# Altium project Racer.PrjPcb
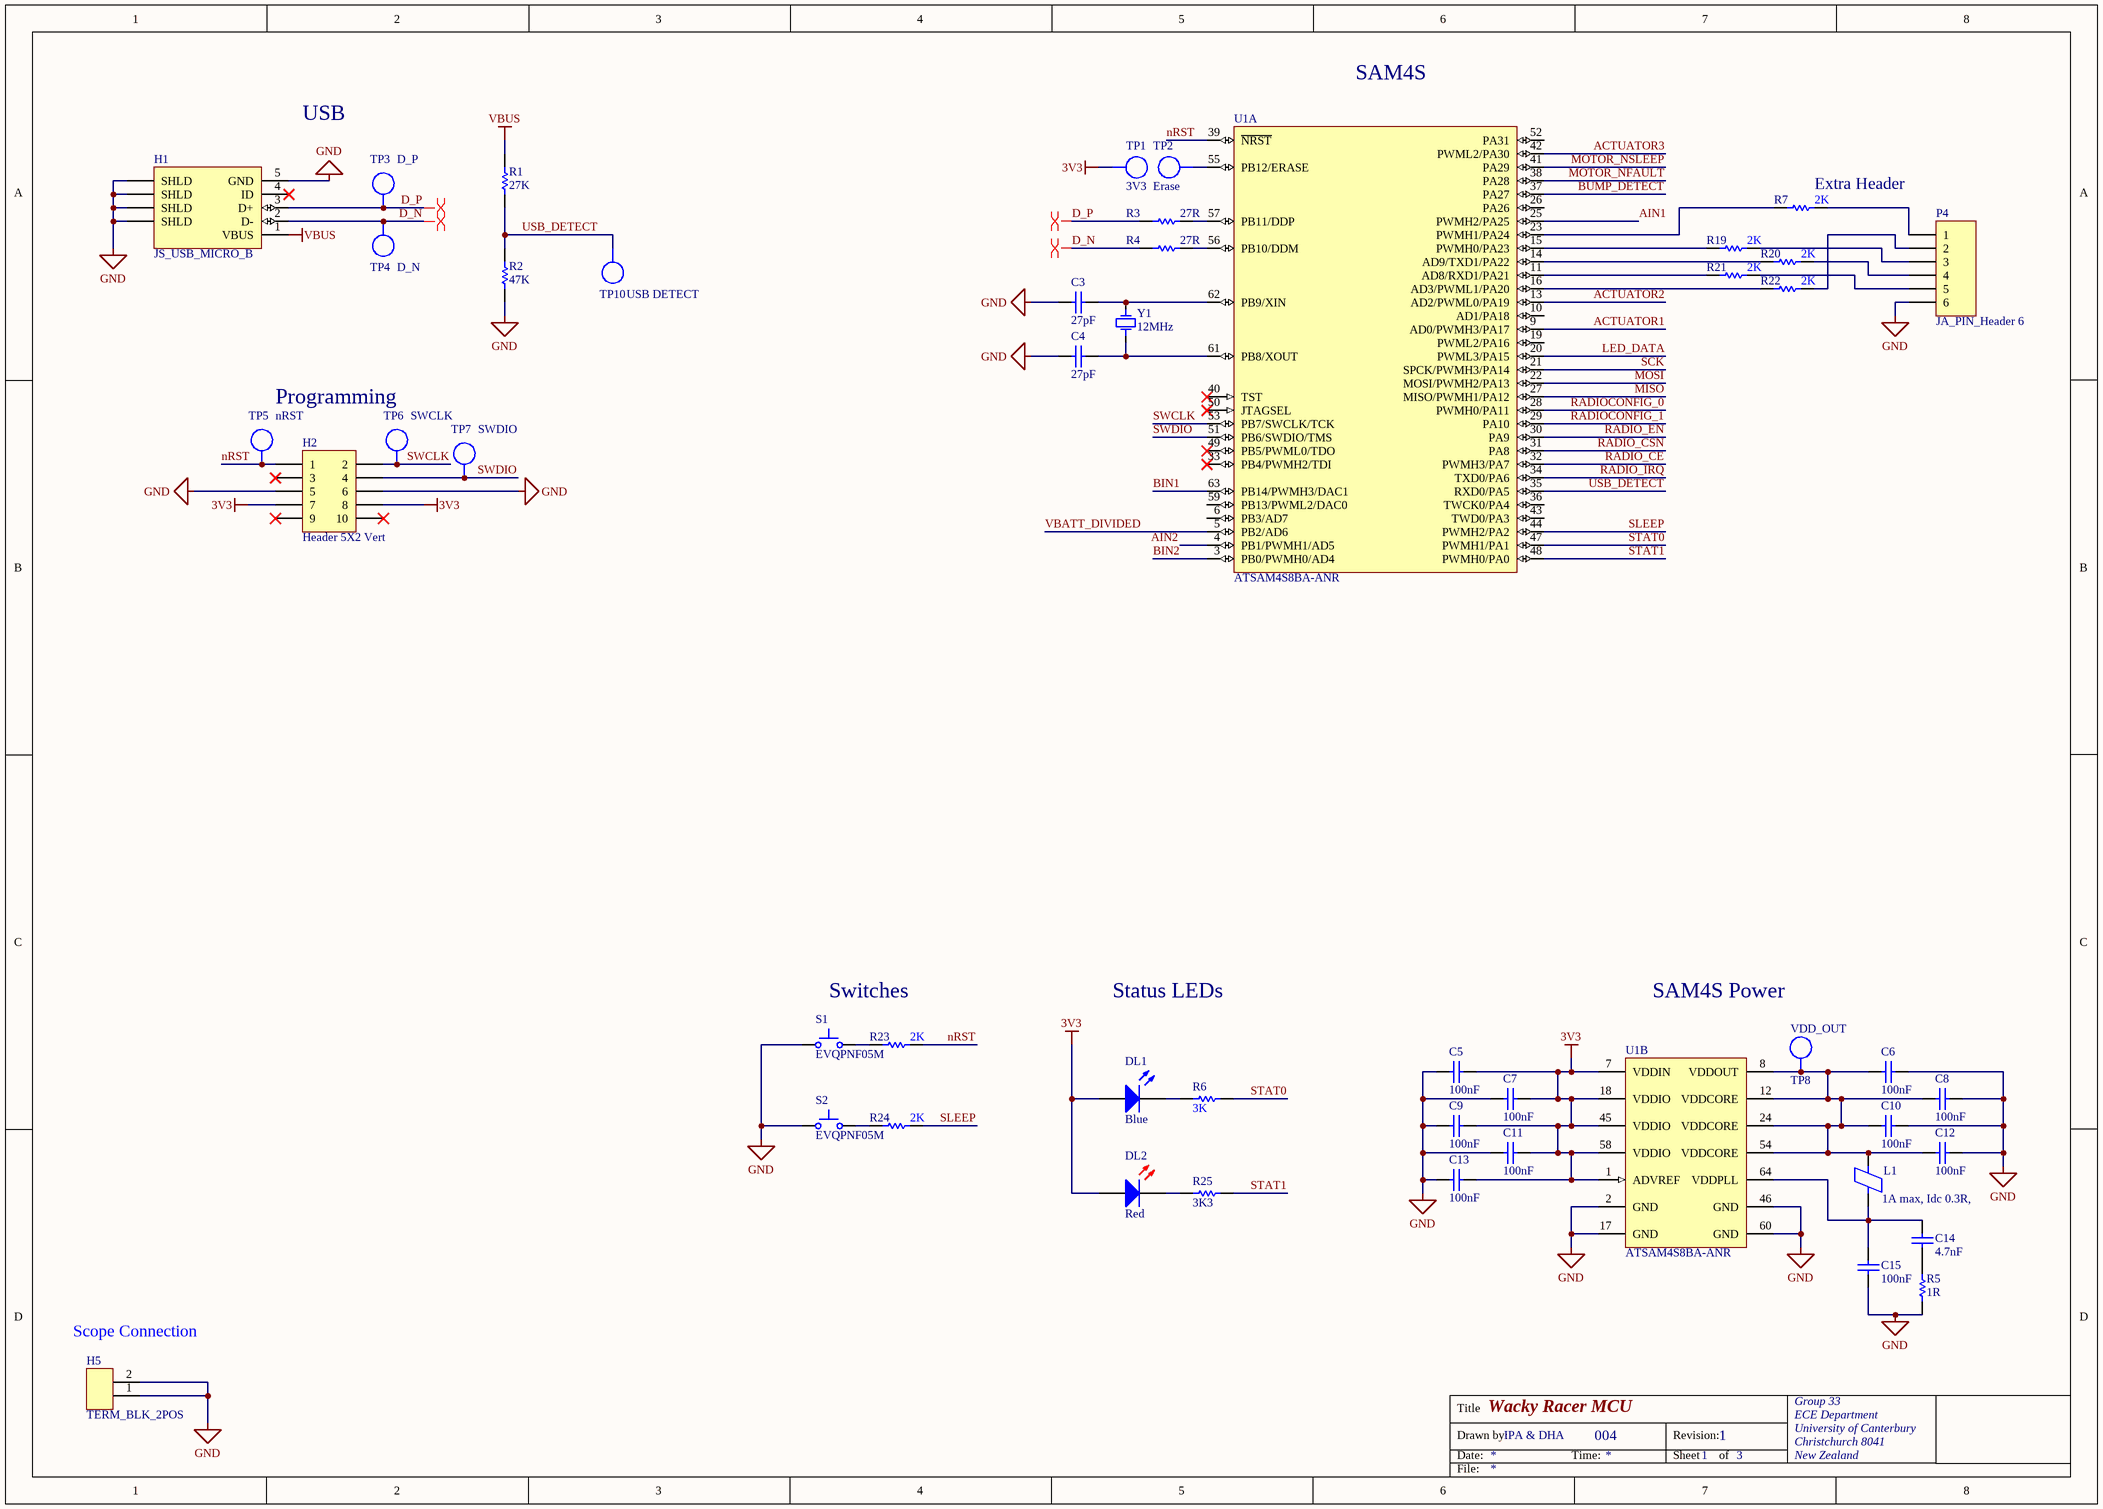
[diagram p0: MCU.SchDoc]
3 sheets, 133 parts. Net scope: global (net labels, ports and power ports of the same name join across sheets).
Board file: Car_PCB.PcbDoc
Sheets:
  MCU.SchDoc
  Peripherals.SchDoc
  Power_Supply.SchDoc

## Sheet MCU.SchDoc: Wacky Racer MCU
size A3; Author: IPA & DHA; DrawnBy: IPA & DHA; Organization: Group 33; Address1: ECE Department; Address2: University of Canterbury; Address3: Christchurch 8041; Address4: New Zealand; DocumentNumber: 004; Revision: 1; SheetNumber: 1; SheetTotal: 3; ImagePath: \\maxwell\elecapp\AltiumDesigner\Templates\uc-logo.png

### Parts
C3  27pF  [CAPC1608L]
C4  27pF  [CAPC1608L]
C5  100nF  [CAPC1608L]
C6  100nF  [CAPC1608L]
C7  100nF  [CAPC1608L]
C8  100nF  [CAPC1608L]
C9  100nF  [CAPC1608L]
C10  100nF  [CAPC1608L]
C11  100nF  [CAPC1608L]
C12  100nF  [CAPC1608L]
C13  100nF  [CAPC1608L]
C14  4.7nF  [CAPC1608L]
C15  100nF  [CAPC1608L]
DL1  Blue  [WL-SMCW0603]
DL2  Red  [WL-SMCW0603]
H1  JS_USB_MICRO_B  [FCI_USB_10118194-0001LF]
H2  Header 5X2 Vert  [IDC2.54-V10D]
H5  TERM_BLK_2POS  [TERM_BLK_2POS]
L1  1A max, Idc 0.3R,  [INDC3216L]
P4  JA_PIN_Header 6  [HDR1X6]
R1  27K  [RESC1608L]
R2  47K  [RESC1608N]
R3  27R  [RESC1608L]
R4  27R  [RESC1608L]
R5  1R  [RESC3216L]
R6  3K  [RESC1608L]
R7  2K  [RESC1608L]
R19  2K  [RESC1608L]
R20  2K  [RESC1608L]
R21  2K  [RESC1608L]
R22  2K  [RESC1608L]
R23  2K  [RESC1608L]
R24  2K  [RESC1608L]
R25  3K3  [RESC1608L]
S1  EVQPNF05M  [EVQPNF05M]
S2  EVQPNF05M  [EVQPNF05M]
TP1  3V3  [TP_1206]  (no BOM)
TP2  Erase  [TP_1206]  (no BOM)
TP3  D_P  [TP_1206]  (no BOM)
TP4  D_N  [TP_1206]  (no BOM)
TP5  nRST  [TP_1206]  (no BOM)
TP6  SWCLK  [TP_1206]  (no BOM)
TP7  SWDIO  [TP_1206]  (no BOM)
TP8  VDD_OUT  [TP_1206]  (no BOM)
TP10  USB DETECT  [TP_1206]  (no BOM)
U1  ATSAM4S8BA-ANR  [LQFP64_L]  (parts A,B of 2)
Y1  12MHz  [6.0X3.5-4]

### Nets
3V3: C5.2 C7.2 C9.2 C11.2 C13.2 DL1.2(A) DL2.2(A) H2.7 H2.8 TP1.1 U1.1(ADVREF) U1.7(VDDIN) U1.18(VDDIO) U1.45(VDDIO) U1.58(VDDIO)
GND: C3.1 C4.1 C5.1 C6.2 C7.1 C8.2 C9.1 C10.2 C11.1 C12.2 C13.1 C15.1 H1.5(GND) H1.6(SHLD) H2.5 H2.6 H5.1 H5.2 P4.6 R2.1 R5.1 S1.1 S2.1 U1.2(GND) U1.17(GND) U1.46(GND) U1.60(GND)
VBUS: H1.1(VBUS) R1.2
ACTUATOR1: U1.9(AD0/PWMH3/PA17)
ACTUATOR2: U1.13(AD2/PWML0/PA19)
ACTUATOR3: U1.42(PWML2/PA30)
AIN1: U1.25(PWMH2/PA25)
AIN2: U1.4(PB1/PWMH1/AD5)
BIN1: U1.63(PB14/PWMH3/DAC1)
BIN2: U1.3(PB0/PWMH0/AD4)
BUMP_DETECT: U1.37(PA27)
D_N: H1.2(D-) R4.1 TP4.1
D_P: H1.3(D+) R3.1 TP3.1
LED_DATA: U1.20(PWML3/PA15)
MISO: U1.27(MISO/PWMH1/PA12)
MOSI: U1.22(MOSI/PWMH2/PA13)
MOTOR_NFAULT: U1.38(PA28)
MOTOR_NSLEEP: U1.41(PA29)
nRST: H2.1 R23.2 TP5.1 U1.39(~{NRST})
RADIO_CE: U1.32(PWMH3/PA7)
RADIO_CSN: U1.31(PA8)
RADIO_EN: U1.30(PA9)
RADIO_IRQ: U1.34(TXD0/PA6)
RADIOCONFIG_0: U1.28(PWMH0/PA11)
RADIOCONFIG_1: U1.29(PA10)
SCK: U1.21(SPCK/PWMH3/PA14)
SLEEP: R24.2 U1.44(PWMH2/PA2)
STAT0: R6.2 U1.47(PWMH1/PA1)
STAT1: R25.2 U1.48(PWMH0/PA0)
SWCLK: H2.2 TP6.1 U1.53(PB7/SWCLK/TCK)
SWDIO: H2.4 TP7.1 U1.51(PB6/SWDIO/TMS)
USB_DETECT: R1.1 R2.2 TP10.1 U1.35(RXD0/PA5)
VBATT_DIVIDED: U1.5(PB2/AD6)
NetC3_2: C3.2 U1.62(PB9/XIN) Y1.3(OSC2)
NetC4_2: C4.2 U1.61(PB8/XOUT) Y1.1(OSC1)
NetC6_1: C6.1 C8.1 C10.1 C12.1 L1.2 TP8.1 U1.8(VDDOUT) U1.12(VDDCORE) U1.24(VDDCORE) U1.54(VDDCORE)
NetC14_1: C14.1 R5.2
NetC14_2: C14.2 C15.2 L1.1 U1.64(VDDPLL)
NetDL1_1: DL1.1(K) R6.1
NetDL2_1: DL2.1(K) R25.1
NetP4_1: P4.1 R7.2
NetP4_2: P4.2 R22.2
NetP4_3: P4.3 R19.2
NetP4_4: P4.4 R20.2
NetP4_5: P4.5 R21.2
NetR3_2: R3.2 U1.57(PB11/DDP)
NetR4_2: R4.2 U1.56(PB10/DDM)
NetR7_1: R7.1 U1.23(PWMH1/PA24)
NetR19_1: R19.1 U1.15(PWMH0/PA23)
NetR20_1: R20.1 U1.14(AD9/TXD1/PA22)
NetR21_1: R21.1 U1.11(AD8/RXD1/PA21)
NetR22_1: R22.1 U1.16(AD3/PWML1/PA20)
NetR23_1: R23.1 S1.2
NetR24_1: R24.1 S2.2
NetTP2_1: TP2.1 U1.55(PB12/ERASE)

Not connected (* = marked no-connect by the designer): H1 4(ID)*; H2 3* 9* 10*; U1 6(PB3/AD7) 10(AD1/PA18) 19(PWML2/PA16) 26(PA26) 33(PB4/PWMH2/TDI)* 36(TWCK0/PA4) 40(TST)* 43(TWD0/PA3) 49(PB5/PWML0/TDO)* 50(JTAGSEL)* 52(PA31) 59(PB13/PWML2/DAC0)

### Layout directives
differential pair: D_N, D_P

### Notes on the sheet
- SAM4S
- USB
- (near R7) Extra Header
- Programming
- Switches
- Status LEDs
- SAM4S Power
- (near H5) Scope Connection
- Title
- Drawn by:
- Date:
- Time:
- Revision:
- Sheet
- of
- File:

### Library data of the parts
C3 C4 = CC_27pF_0603: CAP CER 27pF NPO/COG +-5% 50V 0603; PackageReference: 0603; Code_IPC: 1608 [0603]; Verify: *; Supplier: ECE Dept; Storage Location: PCB Assembly WS; Value: 27pF
C5-C13 C15 = CC_100nF_0603: CAP CER 100nF X7R +-10% 50V 0603; PackageReference: 0603; Code_IPC: 1608 [0603]; Verify: *; Supplier: ECE Dept; Storage Location: PCB Assembly WS; Value: 100nF
C14 = CC_4.7nF_0603: CAP CER 4.7nF X7R +-10% 50V 0603; PackageReference: 0603; Code_IPC: 1608 [0603]; Verify: *; Supplier: ECE Dept; Storage Location: PCB Assembly WS; Value: 4.7nF
DL1 = DL_150060BS75000: LED Blue 270mcd 0603 SMD; Manufacturer: WURTH ELEKTRONIK; Forward Current If: 30; Forward Voltage: 3.2; Luminous Intensity: 270; Viewing Angle: 120°; Wavelength Typ: 470; Pricing: 1=0.3844, 50=0.3252, 100=0.2957, 500=0.2365 (NZD); Supplier 1: Farnell; Supplier Part Number 1: 2322069; Manufacturer Part Number: 150060BS75000; Storage Location: PCB Assembly WS; Supplier: ECE Dept; LED Colour: Blue
DL2 = DL_150060RS75000: LED Red 250mcd 0603 SMD; Manufacturer: WURTH ELEKTRONIK; Forward Current If: 30; Forward Voltage: 2; Lens Shape: Rectangular; Luminous Intensity: 250; Wavelength Typ: 625; Viewing Angle: 140°; LED Mounting: SMD; Supplier 1: Farnell; Supplier Part Number 1: 2322071; Manufacturer Part Number: 150060RS75000; Storage Location: PCB Assembly WS; Supplier: ECE Dept; LED Colour: Red
H1 = JS_USB_MICRO_B_SMT: CONN USB MICRO B RECPT SMT R/A; Manufacturer: FCI; Manufacturer Part Number: 10118194-0001LF; Gender: Receptacle; Number of Contacts: 5; Specifications: USB 2.0; Supplier 1: Digi-Key; Supplier Part Number 1: 609-4618-1-ND; Features: Shielded, Solder Retention; Mounting Type: Surface Mount, Right Angle, Horizontal
H2 = JA_HDR_IDC_5X2_VERT: IDC Header, 2,54mm, 10-Pin, Vert; Supplier: ECE Dept; Supplier 1: Farnell; Supplier Part Number 1: 1096985; Storage Location: ECE Dept Store
H5 = TERM_BLK_2POS: 2 Position Terminal Block 7.62mm spacing
L1 = IN_Ferrite-Bead: Ferrite Bead, Rdc 0.3R, Z100MHZ 600R, Imax 1A, SMD 1206; Manufacturer: FAIR-RITE; Manufacturer PN: 2512066017Y1; DC Current Rating: 1; DC Resistance Max: 0.08; Ferrite Case Style: 1206 ^3216 Metric]; Frequency Range: 50MHz to 1; Impedance: 600; Impedance Tolerance: ± 25%; Supplier: ECE Dept; Storage Location: PCB Assembly WS; Ferrite Mounting: SMD; Supplier 1: Farnell; Supplier Part Number 1: 1612060; Manufacturer Part Number: 2512066017Y1; Value: 1A max, Idc 0.3R,
P4 = JA_PIN_Header 6: Header, 6-Pin; LatestRevisionDate: 17-Jul-2002; LatestRevisionNote: Re-released for DXP Platform.; Publisher: Altium Limited
R1 = RS_27K: RES 27K OHM 1/10W 5% 0603 SMD; Storage Location: PCB Assembly WS; Supplier: ECE Dept; Value: 27K
R2 = RS_47K: RES 47.0K OHM 1/10W 5% 0603 SMD; Storage Location: PCB Assembly WS; Supplier: ECE Dept; Value: 47K
R3 R4 = RS_27R: RES 27 OHM 1/10W 5% 0603 SMD; Storage Location: PCB Assembly WS; Supplier: ECE Dept; Value: 27R
R5 = RT_1R: RES 1R OHM 1/4W 5% 1206 SMD; Storage Location: PCB Assembly WS; Supplier: ECE Dept; Value: 1R
R6 = RS_3K: RES 3K OHM 1/10W 5% 0603 SMD; Storage Location: PCB Assembly WS; Supplier: ECE Dept; Value: 3K
R7 R19-R24 = RS_2K: RES 2K OHM 1/10W 5% 0603 SMD; Storage Location: PCB Assembly WS; Supplier: ECE Dept; Value: 2K
R25 = RS_3K3: RES 3.3K OHM 1/10W 5% 0603 SMD; Storage Location: PCB Assembly WS; Supplier: ECE Dept; Value: 3K3
S1 S2 = WS_EVQPNF05M: Panasonic 6 x 3.5mm SMD Light Touch Switch Type SMD; PackageDescription: 6.0 x 3.5 mm; Supplier 1: Farnell; Supplier Part Number 1: 2079481; Manufacturer: Panasonic; Manufacturer PN: EVQPNF05M; Supplier 2: Digi-Key; Supplier Part Number 2: P13598SCT-ND; Storage Location: PCB Assembly WS; Supplier: ECE Dept
TP1-TP8 TP10 = TP_1206: Test-Point 3.3x1.6x2.1mm SMD; Manufacturer: Harwin Inc; Manufacturer Part Number: S1751-46R; Value: TP; Manufacturer PN: *; Storage Location: ProtoPlace; Mounting Type: Surface Mount; Type: PC Test Point; Supplier 1: Digi-Key; Supplier Part Number 1: 952-1478-2-ND; Supplier 2: Farnell; Supplier Part Number 2: 1826282; Supplier: ECE Dept
U1 = SE_ATSAM4S16BA-MU: IC MCU 32BIT 512KB FLASH 64LQFP; Manufacturer: Atmel; Connectivity: I²C, IrDA, Memory Card, SPI, SSC, UART/USART, USB; Core Processor: ARM® Cortex®-M4; Core Size: 32-Bit; Data Converters: A/D 11x12b, D/A 2x12b; Number of I/O: 47; Peripherals: Brown-out Detect/Reset, DMA, POR, PWM, WDT; Program Memory Size: 512KB (512K x 8); RAM Size: 128K x 8; Speed: 120MHz; Voltage - Supply (Vcc/Vdd): 1.62 V ~ 3.6 V; PackageVersion: revJ, Jul-2007; PackageReference: 64PS; PackageDescription: 64-Pin Quad Flat No-Lead (QFN) Sawn, 9 x 9 x 1.0 mm Body, 0.5 mm Pitch, Exposed Pad; Code_JEDEC: MO-220VMMD-3; ComponentLink1Description: Manufacturer URL; ComponentLink1URL: http://www.atmel.com/; ComponentLink2Description: SAM4S Series Datasheet; ComponentLink2URL: http://www.atmel.com/dyn/resources/prod_documents/11100.pdf; ComponentLink3Description: SAM4S Series Summary; ComponentLink3URL: http://www.atmel.com/dyn/resources/prod_documents/11100S.pdf; Supplier 1: Digi-Key; Package / Case: 64-LQFP; Packaging: Cut Tape (CT); Program Memory Type: FLASH; Supplier Part Number 1: ATSAM4S8BA-ANRCT-ND; Manufacturer Part Number: ATSAM4S8BA-ANR
Y1 = XT_CRYSTAL_12MHz_18pF: CRYSTAL 12MHZ 18PF 6X3.5mm SMD; Manufacturer: CTS-Frequency Controls; Manufacturer Part Number: 406C35D12M00000; ESR (Equivalent Series Resistance): 60 Ohm; Frequency Stability: ±50ppm; Frequency Tolerance: ±30ppm; Operating Mode: Fundamental; Supplier 1: Digi-Key; Height: 0.047" (1.20mm); Load Capacitance: 18pF; Mounting Type: Surface Mount; Operating Temperature: -20°C ~ 70°C; Package / Case: 4-SMD, No Lead (DFN, LCC); Size / Dimension: 0.236" L x 0.138" W (6.00mm x 3.50mm); Supplier Part Number 1: CTX855CT-ND; Frequency: 12MHz

## Sheet Peripherals.SchDoc: Wacky Racer Peripherals
size A3; Author: IPA & DHA; DrawnBy: IPA & DHA; Organization: Group 33; Address1: ECE Department; Address2: University of Canterbury; Address3: Christchurch 8041; Address4: New Zealand; DocumentNumber: 006; Revision: 1; SheetNumber: 2; SheetTotal: 3; ImagePath: \\maxwell\elecapp\AltiumDesigner\Templates\uc-logo.png
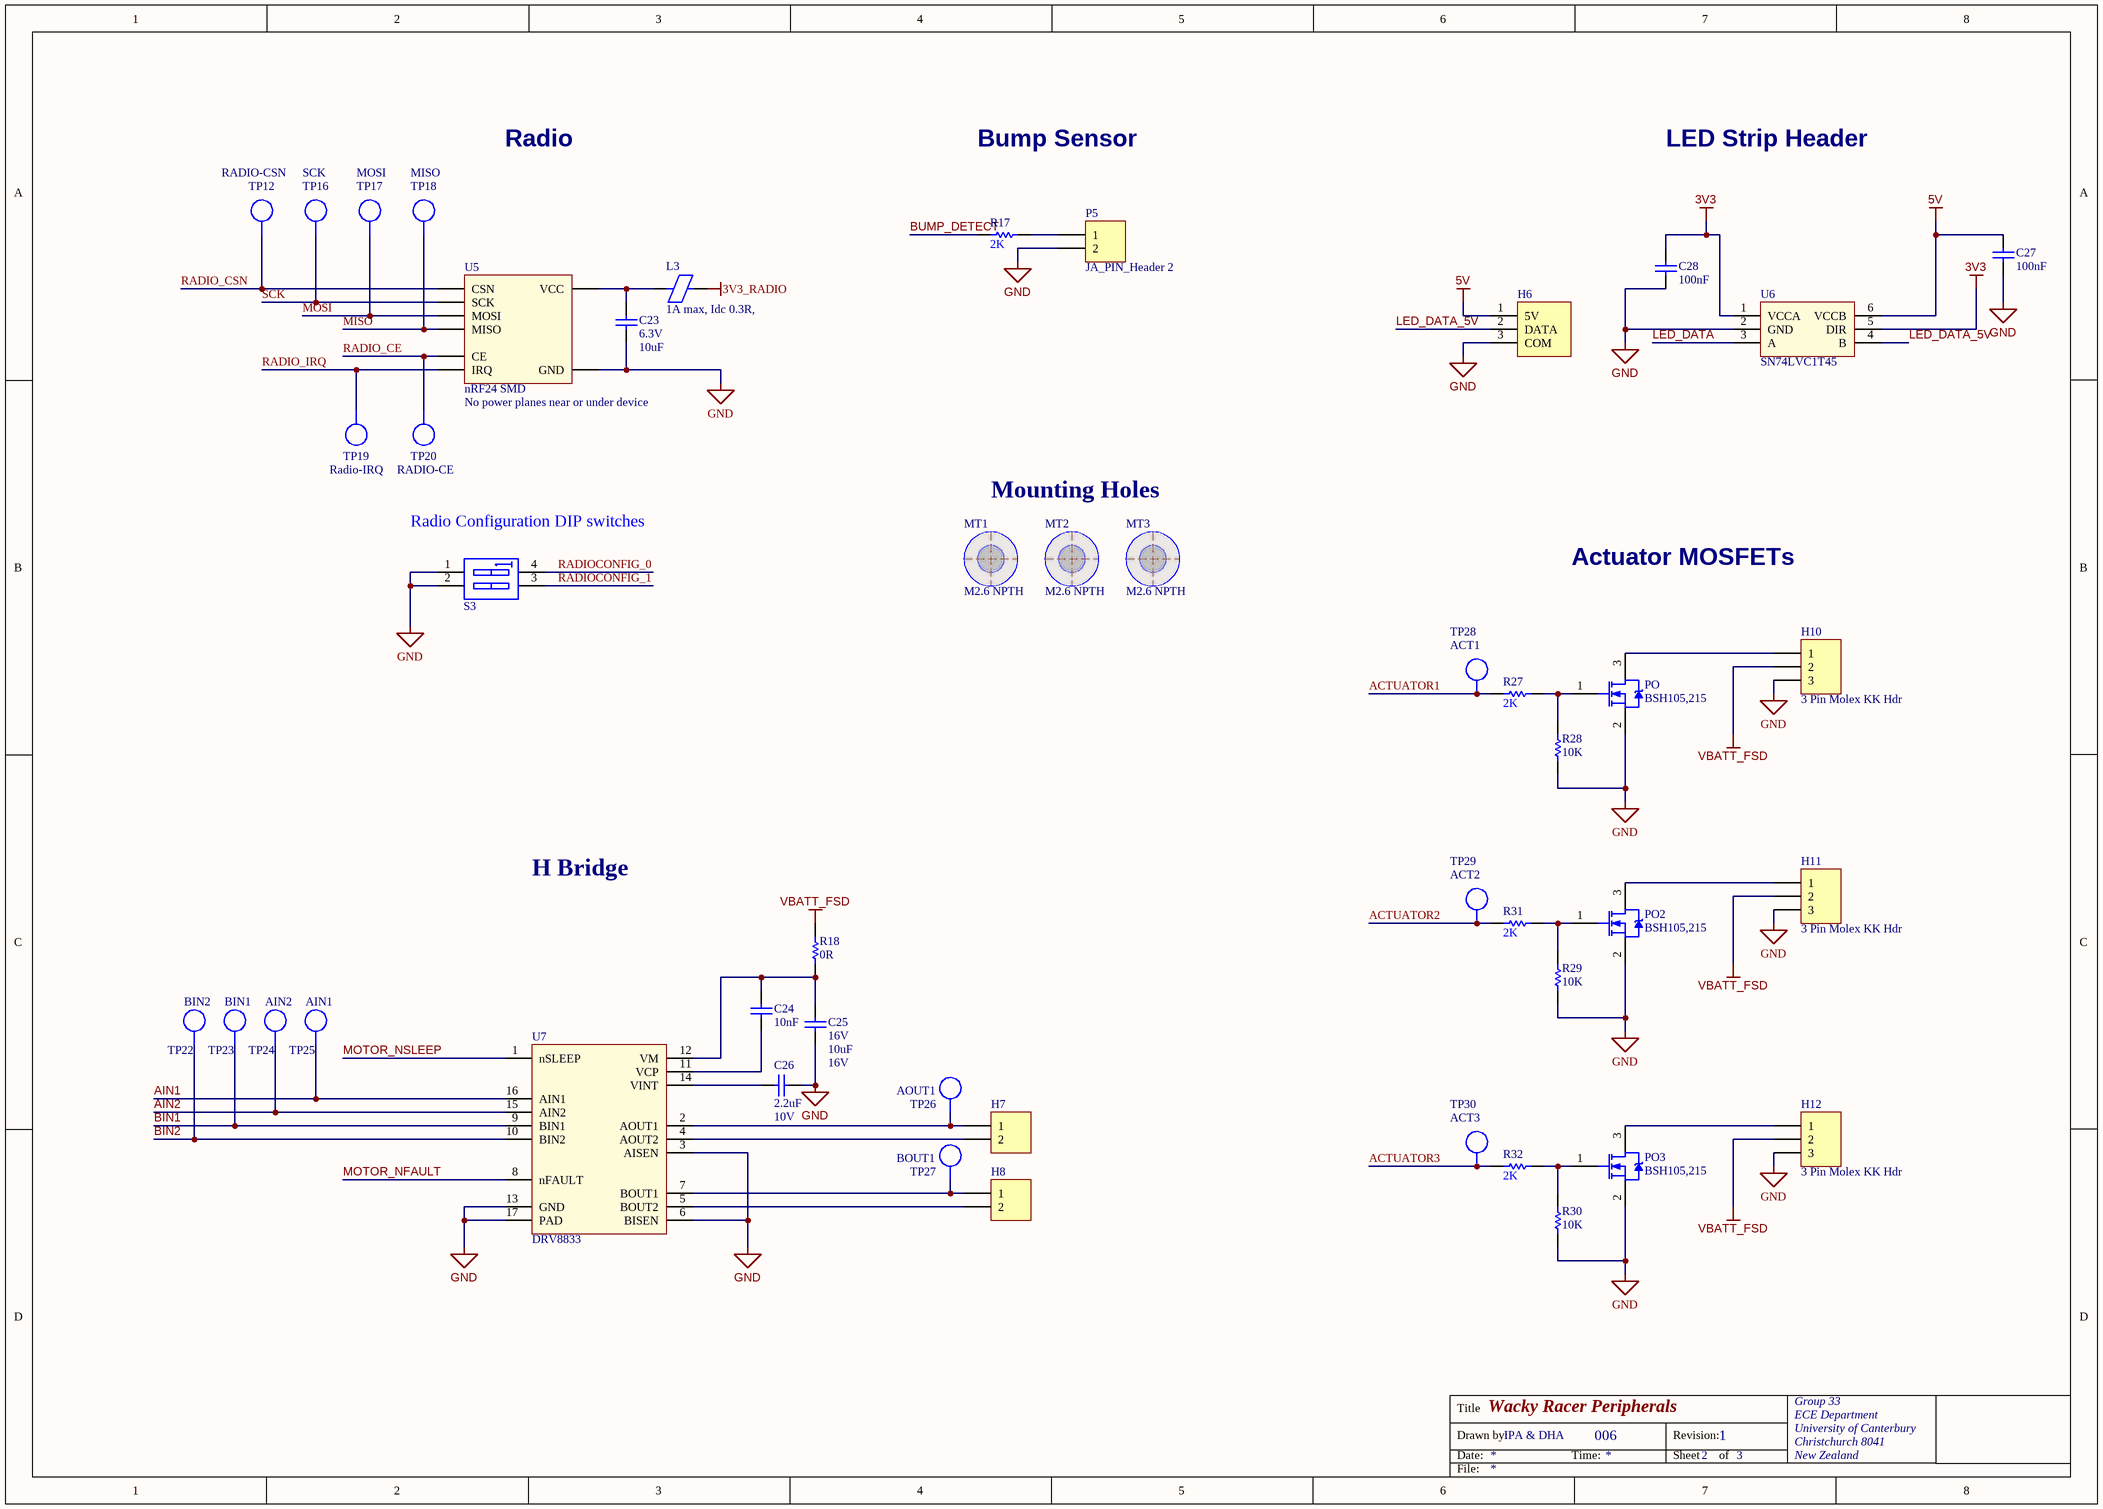
[diagram p1: Peripherals.SchDoc]

### Parts
C23  Voltage - Rated: 6.3V  [CAPC1608L]  (hidden comment: 10uF)
C24  10nF  [CAPC1608L]
C25  Voltage - Rated: 16V  [CAPC2012L]  (hidden comment: 10uF)
C26  Max Voltage: 10V  [CAPC1608L]  (hidden comment: 2.2uF)
C27  100nF  [CAPC1608L]
C28  100nF  [CAPC1608L]
H6  3 Pin Molex KK Hdr  [MOLEX_KK_3_HDR]  (value not drawn)
H7  JA_TERM_BLK_HDR_2 PIN  [TMHDR2]  (value not drawn)
H8  JA_TERM_BLK_HDR_2 PIN  [TMHDR2]  (value not drawn)
H10  3 Pin Molex KK Hdr  [MOLEX_KK_3_HDR]
H11  3 Pin Molex KK Hdr  [MOLEX_KK_3_HDR]
H12  3 Pin Molex KK Hdr  [MOLEX_KK_3_HDR]
L3  1A max, Idc 0.3R,  [INDC3216L]
MT1  M2.6 NPTH  [MNT-HOLE_2.6mm_NPTH]  (no BOM)
MT2  M2.6 NPTH  [MNT-HOLE_2.6mm_NPTH]  (no BOM)
MT3  M2.6 NPTH  [MNT-HOLE_2.6mm_NPTH]  (no BOM)
P5  JA_PIN_Header 2  [HDR1X2]
PO  BSH105,215  [SOT23_L]
PO2  BSH105,215  [SOT23_L]
PO3  BSH105,215  [SOT23_L]
R17  2K  [RESC1608L]
R18  0R  [RESC3216L]
R27  2K  [RESC1608L]
R28  10K  [RESC1608L]
R29  10K  [RESC1608L]
R30  10K  [RESC1608L]
R31  2K  [RESC1608L]
R32  2K  [RESC1608L]
S3  WS_SW DIP-2  [DIP_SW_2WAY_SMD]  (value not drawn)
TP12  RADIO-CSN  [TP_1206]  (no BOM)
TP16  SCK  [TP_1206]  (no BOM)
TP17  MOSI  [TP_1206]  (no BOM)
TP18  MISO  [TP_1206]  (no BOM)
TP19  Radio-IRQ  [TP_1206]  (no BOM)
TP20  RADIO-CE  [TP_1206]  (no BOM)
TP22  BIN2  [TP_1206]  (no BOM)
TP23  BIN1  [TP_1206]  (no BOM)
TP24  AIN2  [TP_1206]  (no BOM)
TP25  AIN1  [TP_1206]  (no BOM)
TP26  AOUT1  [TP_1206]  (no BOM)
TP27  BOUT1  [TP_1206]  (no BOM)
TP28  ACT1  [TP_1206]  (no BOM)
TP29  ACT2  [TP_1206]  (no BOM)
TP30  ACT3  [TP_1206]  (no BOM)
U5  nRF24 SMD  Warning: No power planes near or under device  [NRF24]
U6  SN74LVC1T45  [SOT23-6_N]
U7  DRV8833  [HTSOP16 DRV8833]

### Nets
3V3: C28.2 U6.1(VCCA) U6.5(DIR)
3V3_RADIO: L3.2
5V: C27.2 H6.1(5V) U6.6(VCCB)
GND: C23.1 C25.1 C26.2 C27.1 C28.1 H6.3(COM) H10.3 H11.3 H12.3 P5.2 PO.2 PO2.2 PO3.2 R28.1 R29.1 R30.1 S3.1(A1) S3.2(A2) U5.2(GND) U6.2(GND) U7.3(AISEN) U7.6(BISEN) U7.13(GND) U7.17(PAD)
VBATT_FSD: H10.2 H11.2 H12.2 R18.2
ACTUATOR1: R27.1 TP28.1
ACTUATOR2: R31.1 TP29.1
ACTUATOR3: R32.1 TP30.1
AIN1: TP25.1 U7.16(AIN1)
AIN2: TP24.1 U7.15(AIN2)
BIN1: TP23.1 U7.9(BIN1)
BIN2: TP22.1 U7.10(BIN2)
BUMP_DETECT: R17.1
LED_DATA: U6.3(A)
LED_DATA_5V: H6.2(DATA) U6.4(B)
MISO: TP18.1 U5.7(MISO)
MOSI: TP17.1 U5.6(MOSI)
MOTOR_NFAULT: U7.8(nFAULT)
MOTOR_NSLEEP: U7.1(nSLEEP)
RADIO_CE: TP20.1 U5.3(CE)
RADIO_CSN: TP12.1 U5.4(CSN)
RADIO_IRQ: TP19.1 U5.8(IRQ)
RADIOCONFIG_0: S3.4(B1)
RADIOCONFIG_1: S3.3(B2)
SCK: TP16.1 U5.5(SCK)
NetC23_2: C23.2 L3.1 U5.1(VCC)
NetC24_1: C24.1 U7.11(VCP)
NetC24_2: C24.2 C25.2 R18.1 U7.12(VM)
NetC26_1: C26.1 U7.14(VINT)
NetH7_1: H7.1 TP26.1 U7.2(AOUT1)
NetH7_2: H7.2 U7.4(AOUT2)
NetH8_1: H8.1 TP27.1 U7.7(BOUT1)
NetH8_2: H8.2 U7.5(BOUT2)
NetH10_1: H10.1 PO.3
NetH11_1: H11.1 PO2.3
NetH12_1: H12.1 PO3.3
NetP5_1: P5.1 R17.2
NetPO2_1: PO2.1 R29.2 R31.2
NetPO3_1: PO3.1 R30.2 R32.2
NetPO_1: PO.1 R27.2 R28.2

### Notes on the sheet
- Radio
- Bump Sensor
- LED Strip Header
- Mounting Holes
- (near S3) Radio Configuration DIP switches
- Actuator MOSFETs
- H Bridge
- Title
- Drawn by:
- Date:
- Time:
- Revision:
- Sheet
- of
- File:

### Library data of the parts
C23 = CC_10uF_0603: CAP CER 10UF X5R +-20% 6V3 0603; Supplier: ECE Dept; Storage Location: PCB Assembly WS; Value: 10uF
C24 = CC_10nF_0603: CAP CER 10nF X7R +-10% 50V 0603; PackageReference: 0603; Code_IPC: 1608 [0603]; Verify: *; Supplier: ECE Dept; Storage Location: PCB Assembly WS; Value: 10nF
C25 = CC_10uF_0805_16V: CAP CER 10uF X5R 16V 0805; Manufacturer: Samsung Electro-Mechanics; Manufacturer Part Number: CL21A106KOQNNWE; Note: Footprint corresponds to dimensions for bulk cassette packaging. This case size has tightened tolerances.; Tolerance: ±10%; Notification: Current market demand for these product types have resulted in fluctuating and extending lead times. Lead times may differ.; PackageReference: 0805; Code_IPC: 2012[0805]; Supplier 1: Digi-Key; RoHS: RoHS Compliant; Category: Capacitors; Stock 1: 20000; Pricing 1: 1=0.35, 10=0.25, 100=0.1178, 500=0.08254, 1000=0.06831 (NZD); Packaging: Cut Tape (CT); Part Status: Active; Temperature Coefficient: X5R; Operating Temperature: -55°C ~ 85°C; Features: -; Ratings: -; Applications: General Purpose; Mounting Type: Surface Mount, MLCC; Package / Case: 0805 (2012 Metric); Size / Dimension: 0.079" L x 0.049" W (2.00mm x 1.25mm); Height - Seated (Max): -; Thickness (Max): 0.055" (1.40mm); Lead Spacing: -; Lead Style: -; ComponentLink1URL: http://www.samsungsem.com/kr/support/product-search/mlcc/CL21A106KOQNNWE.jsp; ComponentLink1Description: http://www.samsungsem.com/kr/support/product-search/mlcc/CL21A106KOQNNWE.jsp; Supplier Part Number 1: 1276-2894-1-ND; Value: 10uF; Max Voltage: 16V
C26 = CC_2.2uF_0603: CAP CER 2.2uF X5R +-20% 10V 0603; PackageReference: 0603; Code_IPC: 1608 [0603]; Verify: *; Supplier: ECE Dept; Storage Location: PCB Assembly WS; Value: 2.2uF
C27 C28 = CC_100nF_0603: CAP CER 100nF X7R +-10% 50V 0603; PackageReference: 0603; Code_IPC: 1608 [0603]; Verify: *; Supplier: ECE Dept; Storage Location: PCB Assembly WS; Value: 100nF
H6 = LED_Strip_Header: CONN HEADER 3POS 2.54mm VERT_Thru Hole; Manufacturer: Molex; Manufacturer PN: 22-23-2031; Supplier Part Number 1: 9731156; Supplier: ECE Dept; Supplier 1: Farnell; Storage Location: ECE Dept Store; Value: 3 Pin Molex KK Hdr
H7 H8 = JA_TERM_BLK_HDR_2 PIN: TERM_BLK_HEADER 5.08mm 2 Pos R/A Thru Hole; Manufacturer: Phoenix Contact; Manufacturer Part Number: 1727010; Max Supply Voltage: 160V; Max Current Rating: 12A; Verify: *; Supplier Part Number 1: 3704579; Supplier: ECE Dept; Supplier 1: Farnell; Storage Location: ECE Dept Store; Supplier 2: Digi-Key; Supplier Part Number 2: 277-1947-ND
H10-H12 = JA_MOLEX_KK_3POS: CONN HEADER 3POS 2.54mm VERT_Thru Hole; Manufacturer: Molex; Manufacturer PN: 22-23-2031; Supplier Part Number 1: 9731156; Supplier: ECE Dept; Supplier 1: Farnell; Storage Location: ECE Dept Store; Value: 3 Pin Molex KK Hdr
L3 = IN_Ferrite-Bead: as L1 on sheet MCU; Supplier: ECE Dept; Storage Location: PCB Assembly WS; Ferrite Mounting: SMD; Supplier 1: Farnell; Supplier Part Number 1: 1612060; Manufacturer Part Number: 2512066017Y1; Value: 1A max, Idc 0.3R,
MT1-MT3 = MC_M2.6_HOLE: Fixing M2.6 Mount Hole NPTH; Manufacturer: Hi-Q; Manufacturer PN: 2BV series M2.5 Clearance; price: 0; Supplier: ECE Dept; value: M2.6 NPTH
P5 = JA_PIN_Header 2: Header, 2-Pin; LatestRevisionDate: 17-Jul-2002; LatestRevisionNote: Re-released for DXP Platform.; Publisher: Altium Limited
PO PO2 PO3 = TM_BSH105: MOSFET N-CH 20V 1.05A SOT-23; Manufacturer: NXP Semiconductors; FET Type: MOSFET N-Channel, Metal Oxide; Gate Charge (Qg) @ Vgs: 3.9nC @ 4.5V; Input Capacitance (Ciss) @ Vds: 152pF @ 16V; Power - Max: 417mW; Rds On (Max) @ Id, Vgs: 200 mOhm @ 600mA, 4.5V; Supplier 1: Farnell; Supplier 2: Digi-Key; Current - Continuous Drain (Id) @ 25° C: 1.05A; Drain to Source Voltage (Vdss): 20V; Package / Case: TO-236-3, SC-59, SOT-23-3; Pricing: 1=0.53, 10=0.42, 25=0.3544, 100=0.2885, 250=0.23896, 500=0.1974, 1000=0.14785 (NZD); Supplier Part Number 1: 1758066; Supplier Part Number 2: 568-6215-1-ND; Storage Location: PCB Assembly WS; Supplier: ECE Dept; Manufacturer Part Number: BSH105,215
R17 R27 R31 R32 = RS_2K: RES 2K OHM 1/10W 5% 0603 SMD; Storage Location: PCB Assembly WS; Supplier: ECE Dept; Value: 2K
R18 = RT_0R: RES 0R OHM 1/8W 5% 1206 SMD; Storage Location: PCB Assembly WS; Supplier: ECE Dept; Value: 0R
R28-R30 = RS_10K: RES 10.0K OHM 1/10W 5% 0603 SMD; Storage Location: PCB Assembly WS; Supplier: ECE Dept; Value: 10K
S3 = WS_SW DIP-2: DIP Switch, 2 Position, SPST SMD; Manufacturer: OMRON ELECTRONIC COMPONENTS; Manufacturer Part Number: A6SN-2101; Contact Current DC Max: 25; External Length / Height: 7; No. of Switch Positions: 2; Pitch Spacing: 2.54; PackageReference: DIP-4; Contact Configuration: SPST; Supplier 1: Farnell; Supplier Part Number 1: 2029424; Storage Location: PCB Assembly WS; Supplier: ECE Dept
TP12 TP16-TP20 TP22-TP30 = TP_1206: as TP1 on sheet MCU; Manufacturer PN: *; Storage Location: ProtoPlace; Mounting Type: Surface Mount; Type: PC Test Point; Supplier 1: Digi-Key; Supplier Part Number 1: 952-1478-2-ND; Supplier 2: Farnell; Supplier Part Number 2: 1826282; Supplier: ECE Dept
U5 = NRF24: nRF24 SMD Module
U6 = SN74LVC1T45: 1.8V - 5V level converter
U7 = DRV8833: Dual H-Bridge Motor Driver 1.5A; ComponentLink1Description: DRV8833 Datasheet; ComponentLink1URL: \\maxwell\elecapp\AltiumDesigner\Libraries\DatasheetsNew\ENCE461\drv8833pwpr.pdf

## Sheet Power_Supply.SchDoc: Wacky Racer Power Supply
size A3; Author: IPA & DHA; DrawnBy: IPA & DHA; Organization: Group 33; Address1: ECE Department; Address2: University of Canterbury; Address3: Christchurch 8041; Address4: New Zealand; DocumentNumber: 005; Revision: 1; SheetNumber: 3; SheetTotal: 3; ImagePath: \\maxwell\elecapp\AltiumDesigner\Templates\uc-logo.png
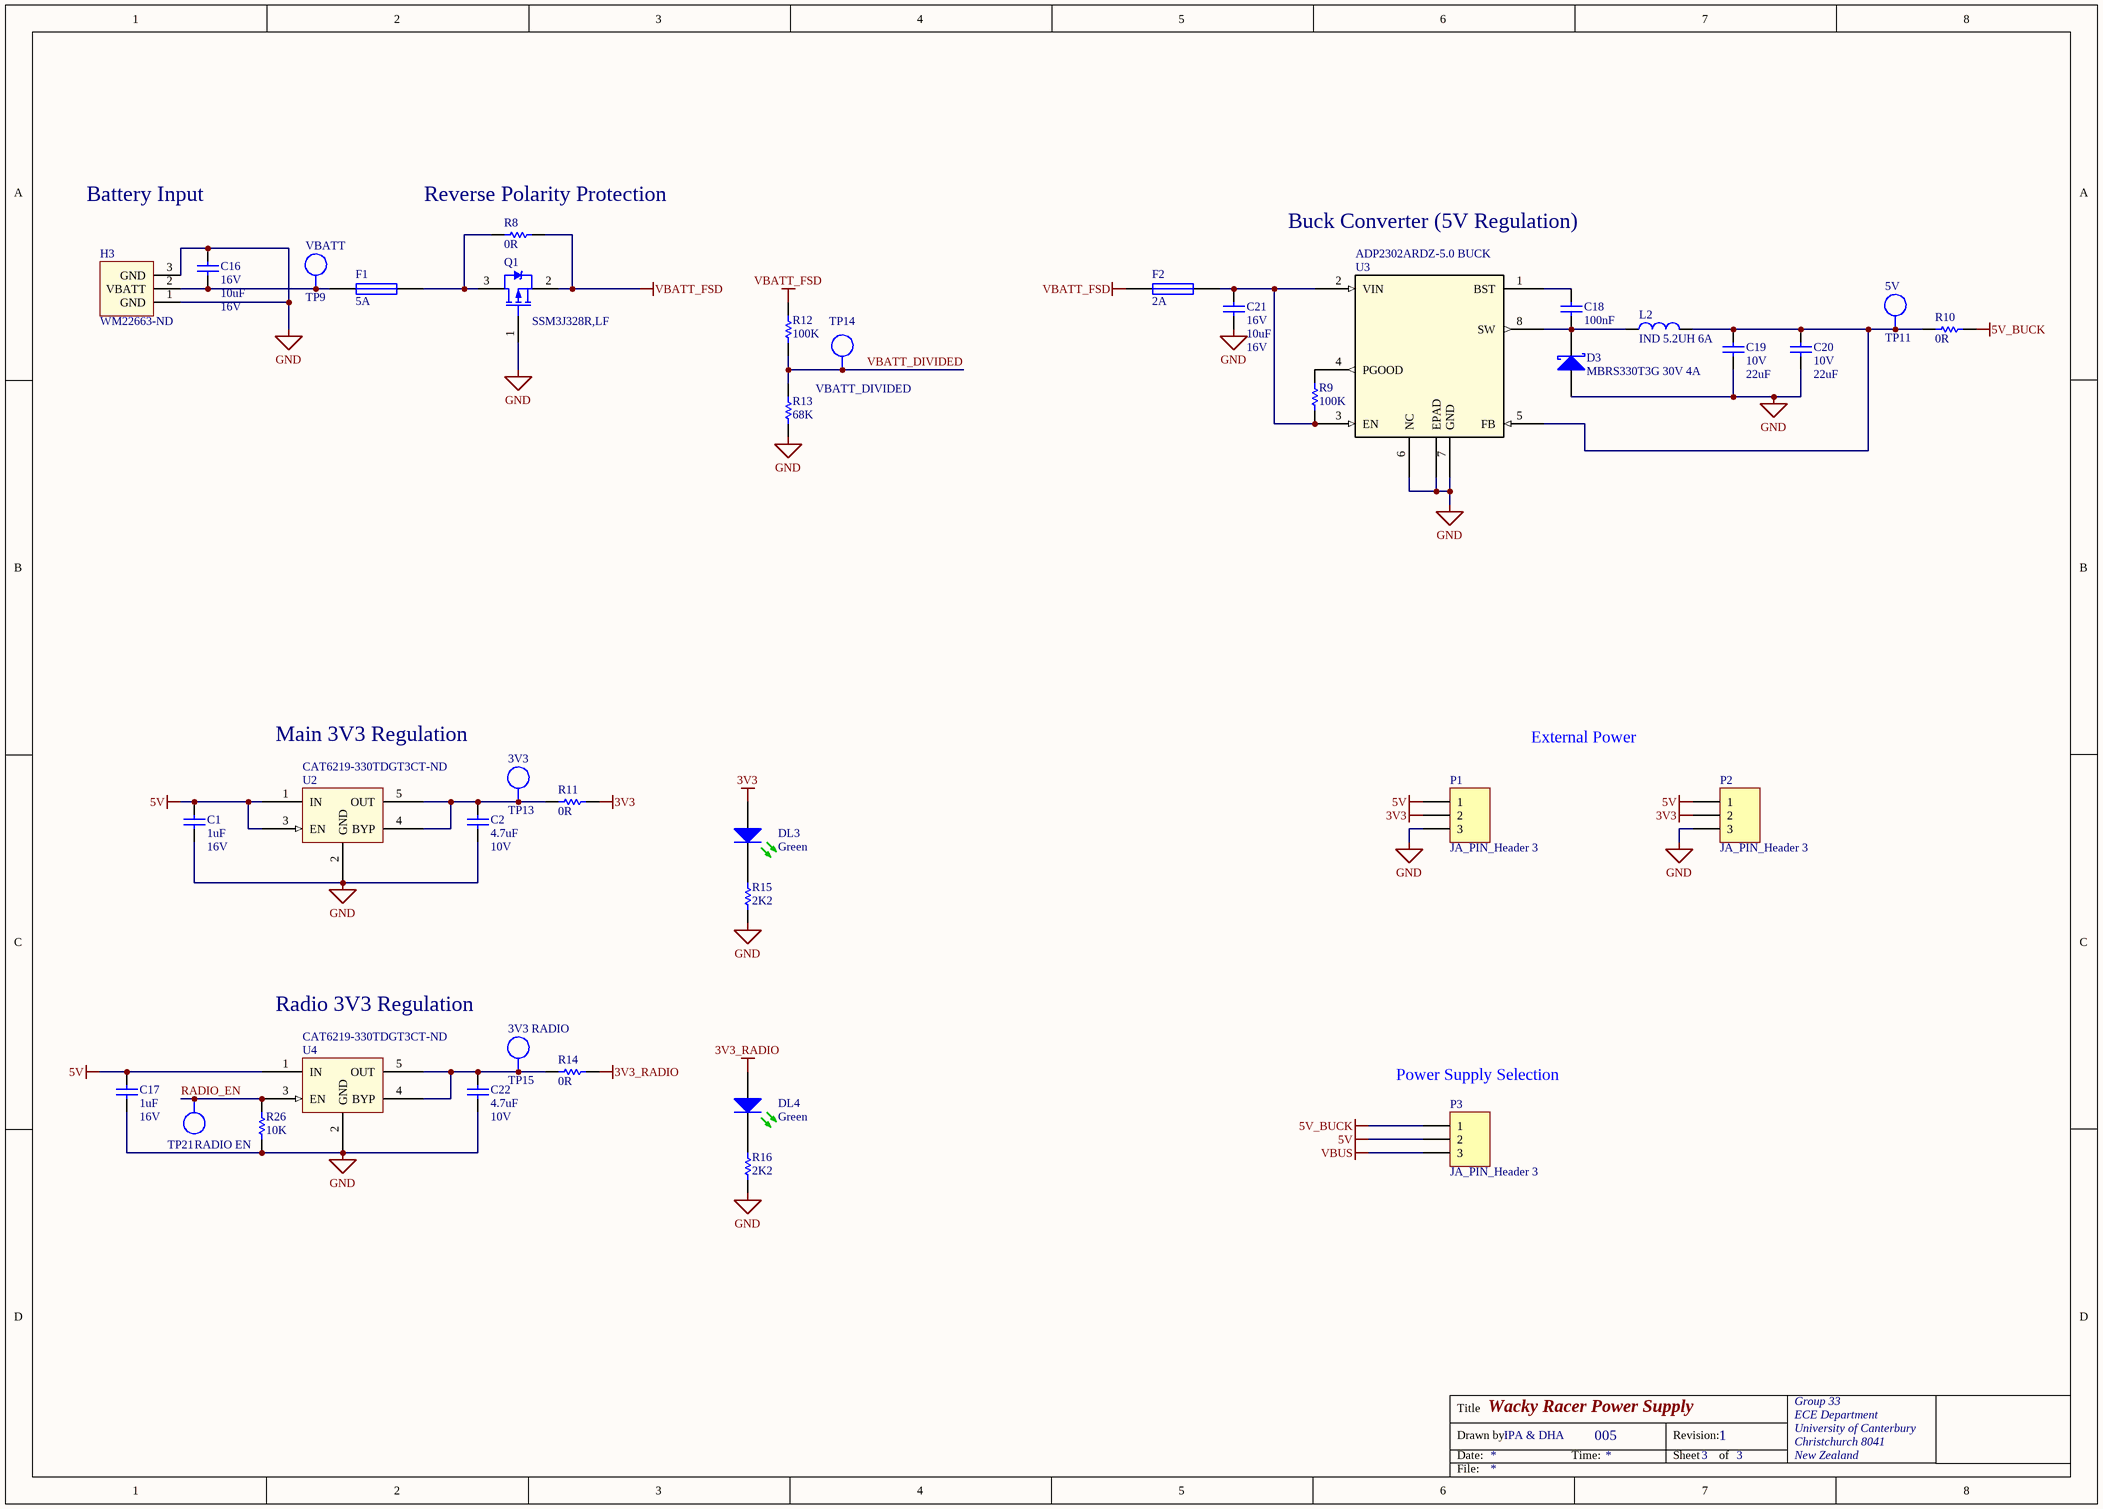
[diagram p2: Power_Supply.SchDoc]

### Parts
C1  Max Voltage: 16V  [CAPC1608L]  (hidden comment: 1uF)
C2  Max Voltage: 10V  [CAPC1608N]  (hidden comment: 4.7uF)
C16  Voltage - Rated: 16V  [CAPC2012L]  (hidden comment: 10uF)
C17  Max Voltage: 16V  [CAPC1608L]  (hidden comment: 1uF)
C18  100nF  [CAPC1608L]
C19  Max Voltage: 10V  [CAPC3216L]  (hidden comment: 22uF)
C20  Max Voltage: 10V  [CAPC3216L]  (hidden comment: 22uF)
C21  Voltage - Rated: 16V  [CAPC2012L]  (hidden comment: 10uF)
C22  Max Voltage: 10V  [CAPC1608N]  (hidden comment: 4.7uF)
D3  MBRS330T3G 30V 4A  [SMC]
DL3  Green  [WL-SMCW0603]
DL4  Green  [WL-SMCW0603]
F1  5A  [RESC3216N]
F2  2A  [RESC3216N]
H3  Supplier Part Number 1: WM22663-ND  [BATT_HEADER_3POS]  (hidden comment: Battery_HEADER_3pin)
L2  IND 5.2UH 6A  [INDUCTOR5u2]
P1  JA_PIN_Header 3  [HDR1X3]
P2  JA_PIN_Header 3  [HDR1X3]
P3  JA_PIN_Header 3  [HDR1X3]
Q1  SSM3J328R,LF  [SOT23_L]
R8  0R  [RESC1608L]
R9  100K  [RESC1608L]
R10  0R  [RESC1608L]
R11  0R  [RESC1608L]
R12  100K  [RESC1608L]
R13  68K  [RESC1608L]
R14  0R  [RESC1608L]
R15  2K2  [RESC1608L]
R16  2K2  [RESC1608L]
R26  10K  [RESC1608L]
TP9  VBATT  [TP_1206]  (no BOM)
TP11  5V  [TP_1206]  (no BOM)
TP13  3V3  [TP_1206]  (no BOM)
TP14  VBATT_DIVIDED  [TP_1206]  (no BOM)
TP15  3V3 RADIO  [TP_1206]  (no BOM)
TP21  RADIO EN  [TP_1206]  (no BOM)
U2  Supplier Part Number: CAT6219-330TDGT3CT-ND  [SOT95P280X145-5N]  (hidden comment: CAT6219-330TDGT3)
U3  ADP2302ARDZ-5.0 BUCK  [RD_8_1]
U4  Supplier Part Number: CAT6219-330TDGT3CT-ND  [SOT95P280X145-5N]  (hidden comment: CAT6219-330TDGT3)

### Nets
3V3: DL3.2(A) P1.2 P2.2 R11.2
3V3_RADIO: DL4.2(A) R14.2
5V: C1.1 C17.1 P1.1 P2.1 P3.2 U2.1(IN) U2.3(EN) U4.1(IN)
5V_BUCK: P3.1 R10.2
GND: C1.2 C2.1 C16.2 C17.2 C19.1 C20.1 C21.1 C22.1 D3.1(A) H3.1(GND) H3.3(GND) P1.3 P2.3 Q1.1 R13.1 R15.1 R16.1 R26.1 U2.2(GND) U3.6(NC) U3.7(GND) U3.EPAD U4.2(GND)
VBATT_FSD: F2.1 Q1.2 R8.2 R12.2
VBUS: P3.3
RADIO_EN: R26.2 TP21.1 U4.3(EN)
VBATT_DIVIDED: R12.1 R13.2 TP14.1
NetC2_2: C2.2 R11.1 TP13.1 U2.4(BYP) U2.5(OUT)
NetC16_1: C16.1 F1.1 H3.2(VBATT) TP9.1
NetC18_1: C18.1 D3.2(K) L2.1 U3.8(SW)
NetC18_2: C18.2 U3.1(BST)
NetC19_2: C19.2 C20.2 L2.2 R10.1 TP11.1 U3.5(FB)
NetC21_2: C21.2 F2.2 R9.1 U3.2(VIN) U3.3(EN)
NetC22_2: C22.2 R14.1 TP15.1 U4.4(BYP) U4.5(OUT)
NetDL3_1: DL3.1(K) R15.2
NetDL4_1: DL4.1(K) R16.2
NetF1_2: F1.2 Q1.3 R8.1
NetR9_2: R9.2 U3.4(PGOOD)

### Notes on the sheet
- Battery Input
- (near R8) Reverse Polarity Protection
- Buck Converter (5V Regulation)
- Main 3V3 Regulation
- External Power
- Radio 3V3 Regulation
- (near P3) Power Supply Selection
- Title
- Drawn by:
- Date:
- Time:
- Revision:
- Sheet
- of
- File:

### Library data of the parts
C1 C17 = CC_1uF_0603: CAP CER 1uF Y5V -20% +80% 16V 0603; PackageReference: 0603; Code_IPC: 1608 [0603]; Verify: *; Supplier: ECE Dept; Storage Location: PCB Assembly WS; Value: 1uF
C2 C22 = CC_4.7uF_0603: CAP CER 4.7uF X5R +-20%  10V 0603; Note: Footprint corresponds to dimensions for bulk cassette packaging. This case size has tightened tolerances.; PackageReference: 0805; Code_IPC: 2012[0805]; Verify: *; Supplier: ECE Dept; Storage Location: PCB Assembly WS; Value: 4.7uF
C16 C21 = CC_10uF_0805_16V: as C25 on sheet Peripherals; PackageReference: 0805; Code_IPC: 2012[0805]; Supplier 1: Digi-Key; RoHS: RoHS Compliant; Category: Capacitors; Stock 1: 20000; Pricing 1: 1=0.35, 10=0.25, 100=0.1178, 500=0.08254, 1000=0.06831 (NZD); Packaging: Cut Tape (CT); Part Status: Active; Temperature Coefficient: X5R; Operating Temperature: -55°C ~ 85°C; Features: -; Ratings: -; Applications: General Purpose; Mounting Type: Surface Mount, MLCC; Package / Case: 0805 (2012 Metric); Size / Dimension: 0.079" L x 0.049" W (2.00mm x 1.25mm); Height - Seated (Max): -; Thickness (Max): 0.055" (1.40mm); Lead Spacing: -; Lead Style: -; ComponentLink1URL: http://www.samsungsem.com/kr/support/product-search/mlcc/CL21A106KOQNNWE.jsp; ComponentLink1Description: http://www.samsungsem.com/kr/support/product-search/mlcc/CL21A106KOQNNWE.jsp; Supplier Part Number 1: 1276-2894-1-ND; Value: 10uF; Max Voltage: 16V
C18 = CC_100nF_0603: CAP CER 100nF X7R +-10% 50V 0603; PackageReference: 0603; Code_IPC: 1608 [0603]; Verify: *; Supplier: ECE Dept; Storage Location: PCB Assembly WS; Value: 100nF
C19 C20 = CC_22uF_1206: CAP CER 22uF Y5V -20% +80% 10V 1206; Verify: *; Supplier: ECE Dept; Storage Location: PCB Assembly WS; Dielectric: Y5V; Footprint: 1206 (3216 metric); Value: 22uF
D3 = MBRS330T3G: SCHOTTKY  30V 4A; Manufacturer: ON Semiconductor; Speed: Fast Recovery =< 500ns, > 200mA (Io); Supplier 1: Digi-Key; Manufacturer Part Number: MBRS330T3G; RoHS: RoHS Compliant; Category: Discrete Semiconductor Products; Stock 1: 8919; Pricing 1: 1=0.93, 10=0.79, 100=0.5902, 500=0.46368, 1000=0.35829 (NZD); Packaging: Cut Tape (CT); Part Status: Active; Diode Type: Schottky; Current - Average Rectified (Io): 4A; Capacitance @ Vr, F: -; Mounting Type: Surface Mount; Package / Case: DO-214AB, SMC; Supplier Device Package: SMC; Operating Temperature - Junction: -65°C ~ 150°C; Base Part Number: MBRS330; ComponentLink1URL: http://www.onsemi.com/pub/Collateral/MBRS340T3-D.PDF; ComponentLink1Description: http://www.onsemi.com/pub/Collateral/MBRS340T3-D.PDF; Supplier Part Number 1: MBRS330T3GOSCT-ND
DL3 DL4 = DL_150060GS75000: LED Green 430mcd 0603 SMD; Manufacturer: WURTH ELEKTRONIK; Forward Current If: 30; Wavelength Typ: 520; Forward Voltage: 3.2; Lens Shape: Rectangular; Luminous Intensity: 430; Viewing Angle: 140°; LED Mounting: SMD; Supplier 1: Farnell; Supplier Part Number 1: 2322070; Manufacturer Part Number: 150060GS75000; Storage Location: PCB Assembly WS; Supplier: ECE Dept; LED Colour: Green
F1 = FS_Fuse_5.0A: Fuse 5.0A Fast Acting 1206 SMD; Manufacturer Part Number: C1F5; Manufacturer: Bel TRP; Voltage Rating (AC): 125V; Voltage Rating (DC): 63V; DC Cold Resistance: 19mR; Fuse Type: Board Mount (Cartridge Style Excluded); Approvals: CE,cURus; Mount: Surface Mount; Case/Package: 1206; Number of Pins: 2; Case Code (Metric): 3216; Case Code (Imperial): 1206; Contact Plating: Nickel,Tin; Min Operating Temperature: -55°C; Max Operating Temperature: 125°C; Packaging: Tape and Reel; Voltage Rating: 125V; Length: 0.126inch; Width: 0.062inch; Supplier 1: Digi-Key; Stock 1: 725; Pricing 1: 1=0.32, 5=0.312, 10=0.298, 50=0.2662, 100=0.2479, 250=0.22032, 500=0.1836, 1000=0.17442 (USD); ComponentLink1URL: http://www.farnell.com/datasheets/2571625.pdf; ComponentLink1Description: http://www.farnell.com/datasheets/2571625.pdf; ComponentLink2URL: http://belfuse.com/pdfs/C1F.pdf; ComponentLink2Description: http://belfuse.com/pdfs/C1F.pdf; ComponentLink3URL: http://www.mouser.com/ds/2/643/C1F-594910.pdf; ComponentLink3Description: http://www.mouser.com/ds/2/643/C1F-594910.pdf; ComponentLink4URL: https://belfuse.com/resources/StewartConnector/C1F.pdf; ComponentLink4Description: https://belfuse.com/resources/StewartConnector/C1F.pdf; Current Rating: 5A; Supplier Part Number 1: 507-1886-1-ND; Supplier 2: Element14; Supplier Part Number 2: 2848595; Value: 5A
F2 = FS_Fuse_2.0A: Fuse 2.0A Very Fast Acting 1206 SMD; Manufacturer: MULTICOMP; Manufacturer PN: MC12CF 002; Supplier: ECE Dept; Storage Location: PCB Assembly WS; Supplier 1: Farnell; Supplier Part Number 1: 1841029; Manufacturer Part Number: MC12CF 002; Value: 2A
H3 = Battery_HEADER_3pin: 3Pin Header 2.54mm spacing / Digikey #WM22663-ND; Supplier 1: Digi-Key
L2 = CDRH104RNP-5R2NC: FIXED IND 5.2UH 6A 22 MOHM SMD; Manufacturer: Sumida America Components Inc.; Material - Core: Ferrite; Tolerance: ±30%; Current - Saturation: 5.6A; Shielding: Shielded; DC Resistance (DCR): 22 mOhm Max; Supplier 1: Digi-Key; Manufacturer Part Number: CDRH104RNP-5R2NC; RoHS: RoHS Compliant; Category: Inductors, Coils, Chokes; Stock 1: 3849; Pricing 1: 1=2.9, 10=2.678, 100=1.8743, 500=1.5173 (NZD); Packaging: Cut Tape (CT); Part Status: Active; Type: -; Q @ Freq: -; Frequency - Self Resonant: -; Ratings: -; Operating Temperature: -40°C ~ 100°C; Mounting Type: Surface Mount; Package / Case: Nonstandard; Supplier Device Package: -; Size / Dimension: 0.402" L x 0.394" W (10.20mm x 10.00mm); Height - Seated (Max): 0.157" (4.00mm); ComponentLink1URL: http://products.sumida.com/products/pdf/CDRH104R.pdf; ComponentLink1Description: http://products.sumida.com/products/pdf/CDRH104R.pdf; Supplier Part Number 1: 308-2280-1-ND
P1-P3 = JA_PIN_Header 3: Header, 3-Pin; LatestRevisionDate: 17-Jul-2002; LatestRevisionNote: Re-released for DXP Platform.; Publisher: Altium Limited
Q1 = TM_SSM3J328R: MOSFET P-CH 20V 6A SOT23-3; Manufacturer: Toshiba; FET Feature: Logic Level Gate, 1.5V Drive; FET Type: MOSFET P-Channel, Metal Oxide; Gate Charge (Qg) @ Vgs: 12.8nC @ 4.5V; Input Capacitance (Ciss) @ Vds: 840pF @ 10V; Power - Max: 1W; Rds On Max: 29.8mR; Drain to Source Resistance: 47.4mR; Turn-On Delay Time: 32ns; Power Dissipation: 2W; Number of Channels: 1; Turn-Off Delay Time: 107ns; Gate to Source Voltage (Vgs): 8V; Input Capacitance: 840pF; Element Configuration: Single; Drain to Source Breakdown Voltage: -20V; Vgs(th) (Max) @ Id: 1V @ 1mA; Current - Continuous Drain (Id) @ 25° C: 6A; Drain to Source Voltage (Vdss): 20V; Package / Case: SOT-23-3 Flat Leads; Supplier Device Package: SOT-23F; Pricing: 1=0.79, 10=0.658, 25=0.5772, 100=0.4939, 250=0.42836, 500=0.36284, 1000=0.27972 (NZD); Storage Location: PCB Assembly WS; Supplier: Digi-Key; ComponentLink1URL: https://datasheet.ciiva.com/11158/ssm3j328r-datasheet-en-20140301-11158652.pdf; ComponentLink1Description: https://datasheet.ciiva.com/11158/ssm3j328r-datasheet-en-20140301-11158652.pdf; Supplier Part Number: SSM3J328RLFDKR-ND; Max Operating Temperature: 150°C; Mount: Surface Mount; Packaging: Tape and Reel; Min Operating Temperature: -55°C; Continuous Drain Current (ID): 6A; Radiation Hardening: No; Max Power Dissipation: 1W; Package Quantity: 3000; Case/Package: SOT-23-3; Number of Pins: 3; Number of Elements: 1; Supplier 1: Digi-Key; Supplier Part Number 1: SSM3J328RLFDKR-ND; Manufacturer Part Number: SSM3J328R,LF
R8 R10 R11 R14 = RS_0R0: RES 0.0 OHM 1/10W 5% 0603 SMD; Storage Location: PCB Assembly WS; Supplier: ECE Dept; Value: 0R
R9 R12 = RS_100K: RES 100K OHM 1/10W 5% 0603 SMD; Storage Location: PCB Assembly WS; Supplier: ECE Dept; Value: 100K
R13 = RS_68K: RES 68.0K OHM 1/10W 5% 0603 SMD; Storage Location: PCB Assembly WS; Supplier: ECE Dept; Value: 68K
R15 R16 = RS_2K2: RES 2.2K OHM 1/10W 5% 0603 SMD; Storage Location: PCB Assembly WS; Supplier: ECE Dept; Value: 2K2
R26 = RS_10K: RES 10.0K OHM 1/10W 5% 0603 SMD; Storage Location: PCB Assembly WS; Supplier: ECE Dept; Value: 10K
TP9 TP11 TP13-TP15 TP21 = TP_1206: as TP1 on sheet MCU; Manufacturer PN: *; Storage Location: ProtoPlace; Mounting Type: Surface Mount; Type: PC Test Point; Supplier 1: Digi-Key; Supplier Part Number 1: 952-1478-2-ND; Supplier 2: Farnell; Supplier Part Number 2: 1826282; Supplier: ECE Dept
U2 U4 = SV_CAT6219-330TDGT3: IC REG LIN 3.3V 500MA TSOT23-5; Voltage - Input (Max): 5.5V; Voltage Dropout (Max): 0.5V @ 500mA; Manufacturer Part Number: CAT6219-330TDGT3; Base Part Number: CAT6219; Current - Output: 500mA; Package / Case: SOT-23-5 Thin, TSOT-23-5; Supplier: Digi-Key; Supplier Device Package: TSOT-23-5; Voltage - Output (Min/Fixed): 3.3V; ComponentLink1URL: http://www.onsemi.com/pub/Collateral/CAT6219-D.PDF; ComponentLink1Description: http://www.onsemi.com/pub/Collateral/CAT6219-D.PDF; Supplier 1: Digi-Key; ComponentLink2Description: CAT6219 Datasheet; ComponentLink2URL: \\maxwell\elecapp\AltiumDesigner\Libraries\DatasheetsNew\ENCE461\CAT6219-D.PDF
U3 = ADP2302ARDZ-5.0-R7: IC REG BUCK 5V 2A 8SOIC; Vendor: Analog Devices Inc; Frequency - Switching: 700kHz; Output Type: Fixed; Voltage - Input (Max): 20V; Manufacturer_Part_Number: ADP2302ARDZ-5.0-R7; Type: DEV; Value: Value; Supplier 1: Digi-Key; Current - Output: 2A; Voltage - Output (Min/Fixed): 5V; Supplier Part Number 1: ADP2302ARDZ-5.0-R7CT-ND; ComponentLink1Description: ADP2302ARDZ-5.0 Datasheet; ComponentLink1URL: \\maxwell\elecapp\AltiumDesigner\Libraries\DatasheetsNew\ENCE461\ADP2302_2303.pdf

## Nets that join several sheets
3V3: MCU (15 pins), Peripherals (C28.2 U6.1 U6.5), Power_Supply (DL3.2 P1.2 P2.2 R11.2)
3V3_RADIO: Peripherals (L3.2), Power_Supply (DL4.2 R14.2)
5V: Peripherals (C27.2 H6.1 U6.6), Power_Supply (8 pins)
GND: MCU (27 pins), Peripherals (24 pins), Power_Supply (23 pins)
VBATT_FSD: Peripherals (H10.2 H11.2 H12.2 R18.2), Power_Supply (F2.1 Q1.2 R8.2 R12.2)
VBUS: MCU (H1.1 R1.2), Power_Supply (P3.3)
ACTUATOR1: MCU (U1.9), Peripherals (R27.1 TP28.1)
ACTUATOR2: MCU (U1.13), Peripherals (R31.1 TP29.1)
ACTUATOR3: MCU (U1.42), Peripherals (R32.1 TP30.1)
AIN1: MCU (U1.25), Peripherals (TP25.1 U7.16)
AIN2: MCU (U1.4), Peripherals (TP24.1 U7.15)
BIN1: MCU (U1.63), Peripherals (TP23.1 U7.9)
BIN2: MCU (U1.3), Peripherals (TP22.1 U7.10)
BUMP_DETECT: MCU (U1.37), Peripherals (R17.1)
LED_DATA: MCU (U1.20), Peripherals (U6.3)
MISO: MCU (U1.27), Peripherals (TP18.1 U5.7)
MOSI: MCU (U1.22), Peripherals (TP17.1 U5.6)
MOTOR_NFAULT: MCU (U1.38), Peripherals (U7.8)
MOTOR_NSLEEP: MCU (U1.41), Peripherals (U7.1)
RADIO_CE: MCU (U1.32), Peripherals (TP20.1 U5.3)
RADIO_CSN: MCU (U1.31), Peripherals (TP12.1 U5.4)
RADIO_EN: MCU (U1.30), Power_Supply (R26.2 TP21.1 U4.3)
RADIO_IRQ: MCU (U1.34), Peripherals (TP19.1 U5.8)
RADIOCONFIG_0: MCU (U1.28), Peripherals (S3.4)
RADIOCONFIG_1: MCU (U1.29), Peripherals (S3.3)
SCK: MCU (U1.21), Peripherals (TP16.1 U5.5)
VBATT_DIVIDED: MCU (U1.5), Power_Supply (R12.1 R13.2 TP14.1)